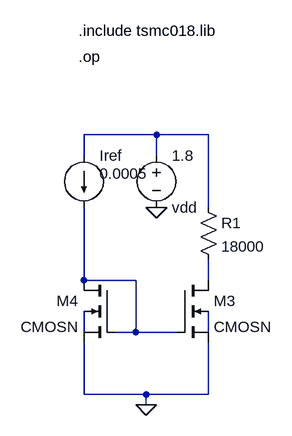
[diagram p0: schematic currentmirrorlt.asc]
currentmirrorlt.asc, the LTspice schematic file:
Version 4.1
SHEET 1 880 680
WIRE 192 -96 80 -96
WIRE 272 -96 192 -96
WIRE 80 -64 80 -96
WIRE 192 -64 192 -96
WIRE 272 16 272 -96
WIRE 80 128 80 16
WIRE 160 128 80 128
WIRE 272 128 272 96
WIRE 80 144 80 128
WIRE 80 208 80 176
WIRE 160 208 160 128
WIRE 160 208 128 208
WIRE 224 208 160 208
WIRE 272 208 272 176
WIRE 80 304 80 224
WIRE 176 304 80 304
WIRE 272 304 272 224
WIRE 272 304 176 304
WIRE 176 320 176 304
FLAG 176 320 0
FLAG 192 16 0
SYMBOL res 256 0 R0
SYMATTR InstName R1
SYMATTR Value 18000
SYMBOL current 80 -64 R0
WINDOW 3 24 28 Left 2
WINDOW 123 0 0 Left 0
WINDOW 39 0 0 Left 0
SYMATTR InstName Iref
SYMATTR Value 0.0005
SYMBOL voltage 192 -80 R0
WINDOW 123 0 0 Left 0
WINDOW 39 0 0 Left 0
SYMATTR InstName 1.8
SYMATTR Value vdd
SYMBOL nmos4 224 128 R0
SYMATTR InstName M3
SYMATTR Value CMOSN
SYMATTR Value2 l=1u w=50u
SYMBOL nmos4 128 128 M0
SYMATTR InstName M4
SYMATTR Value CMOSN
SYMATTR Value2 l=1u w=50u
TEXT 72 -256 Left 2 !.include tsmc018.lib
TEXT 72 -216 Left 2 !.op

The netlist it stands for:
* currentmirrorlt.asc
R1 N001 N003 18000
Iref N001 N002 0.0005
V§1.8 N001 0 vdd
M3 N003 N002 0 N005 CMOSN l=1u w=50u
M4 N002 N002 0 N004 CMOSN l=1u w=50u
.model NMOS NMOS
.model PMOS PMOS
.lib standard.mos
.include tsmc018.lib
.op
.backanno
.end